# EAGLE schematic Longboard (EAGLE 9.1.3)

## Sheet 1 of 3
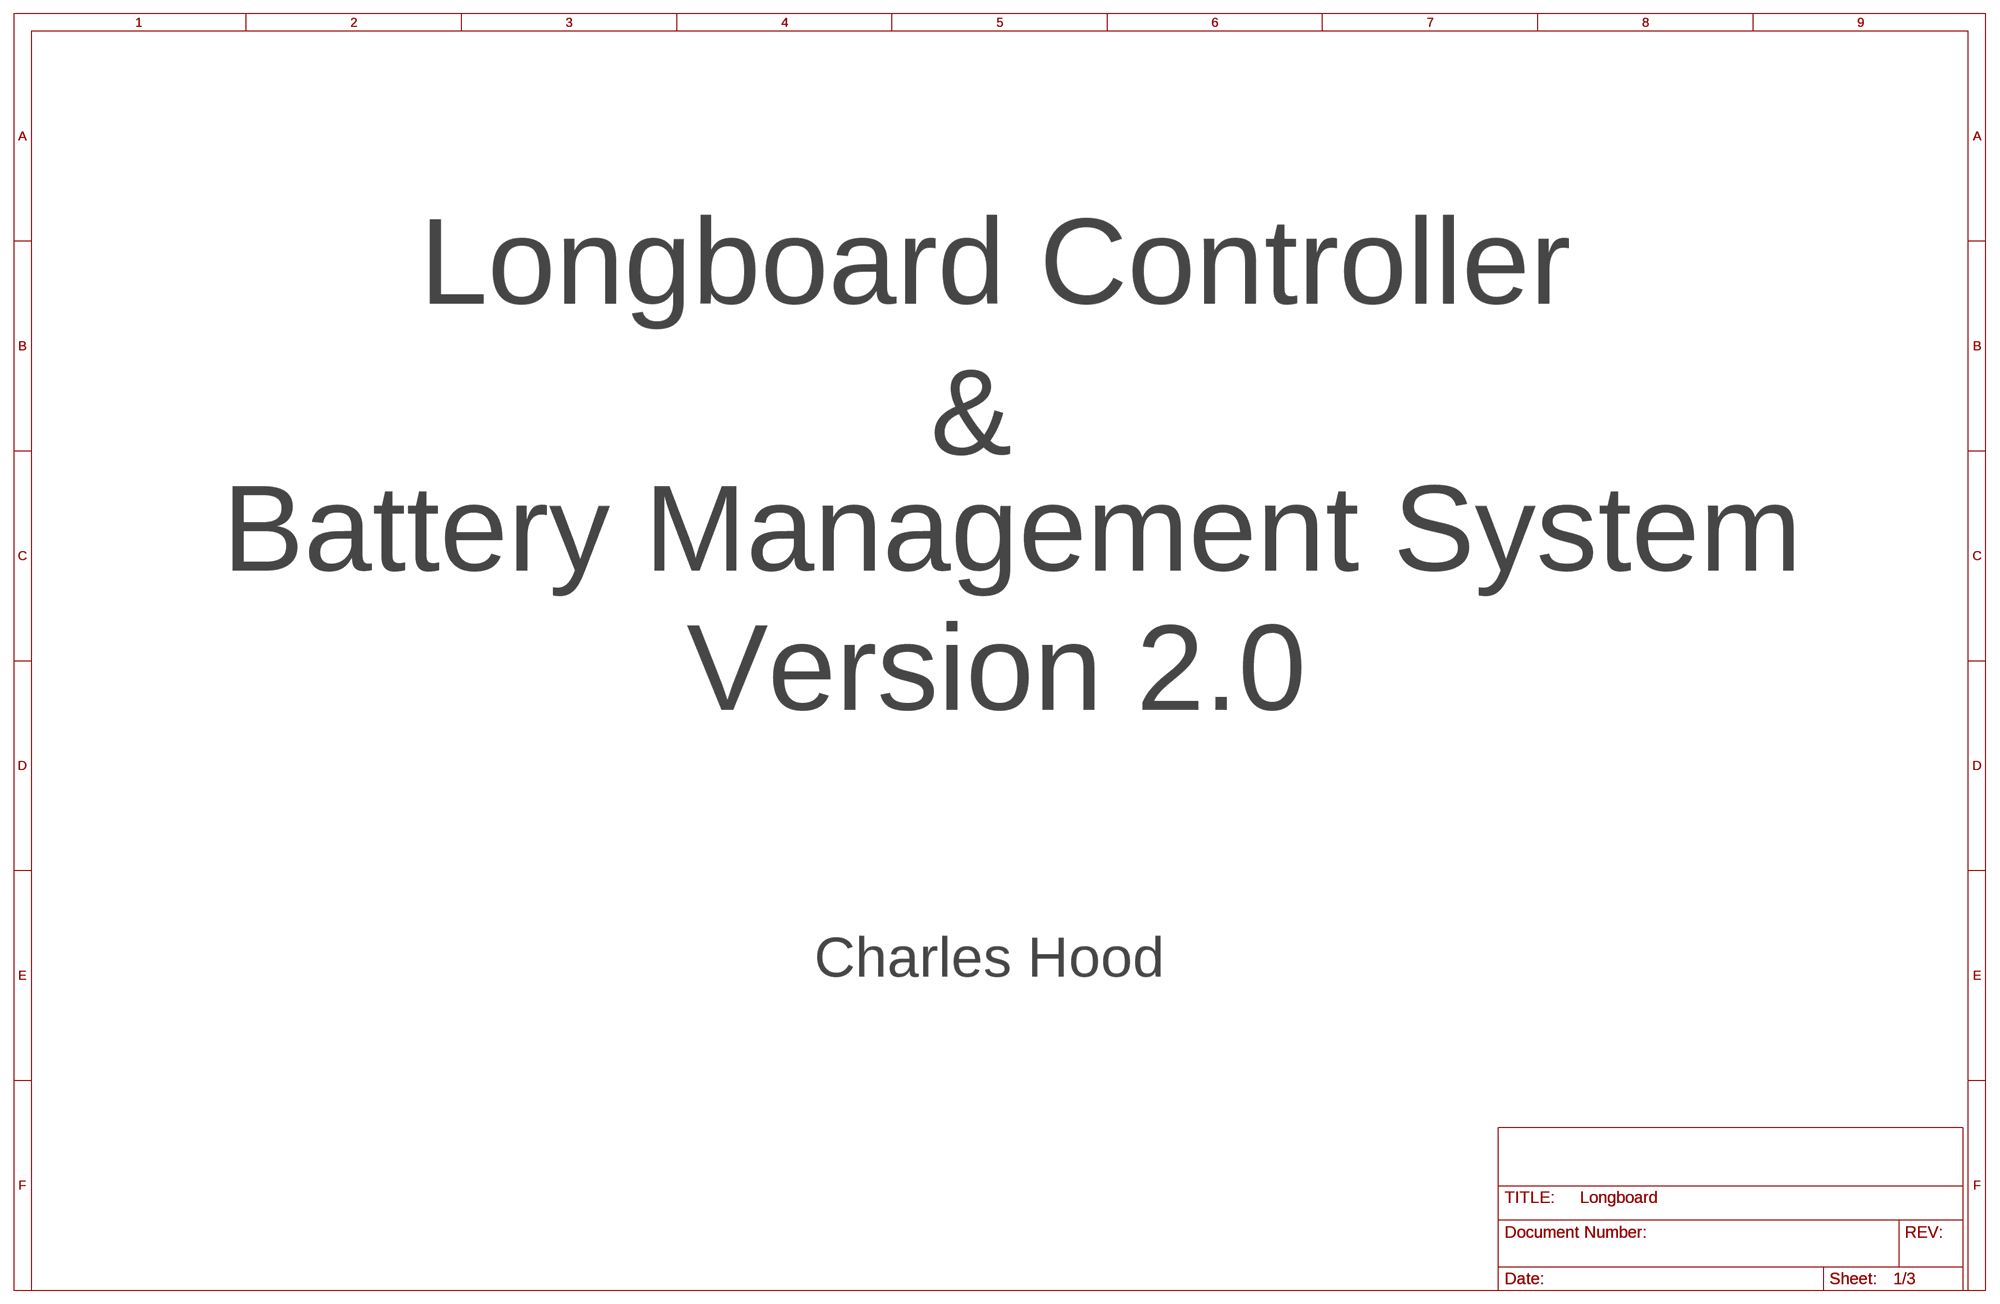
[diagram p0: schematic, sheet 1]

### Notes on the sheet
- Longboard Controller
- &
- Battery Management System
- Version 2.0
- Charles Hood

## Sheet 2 of 3
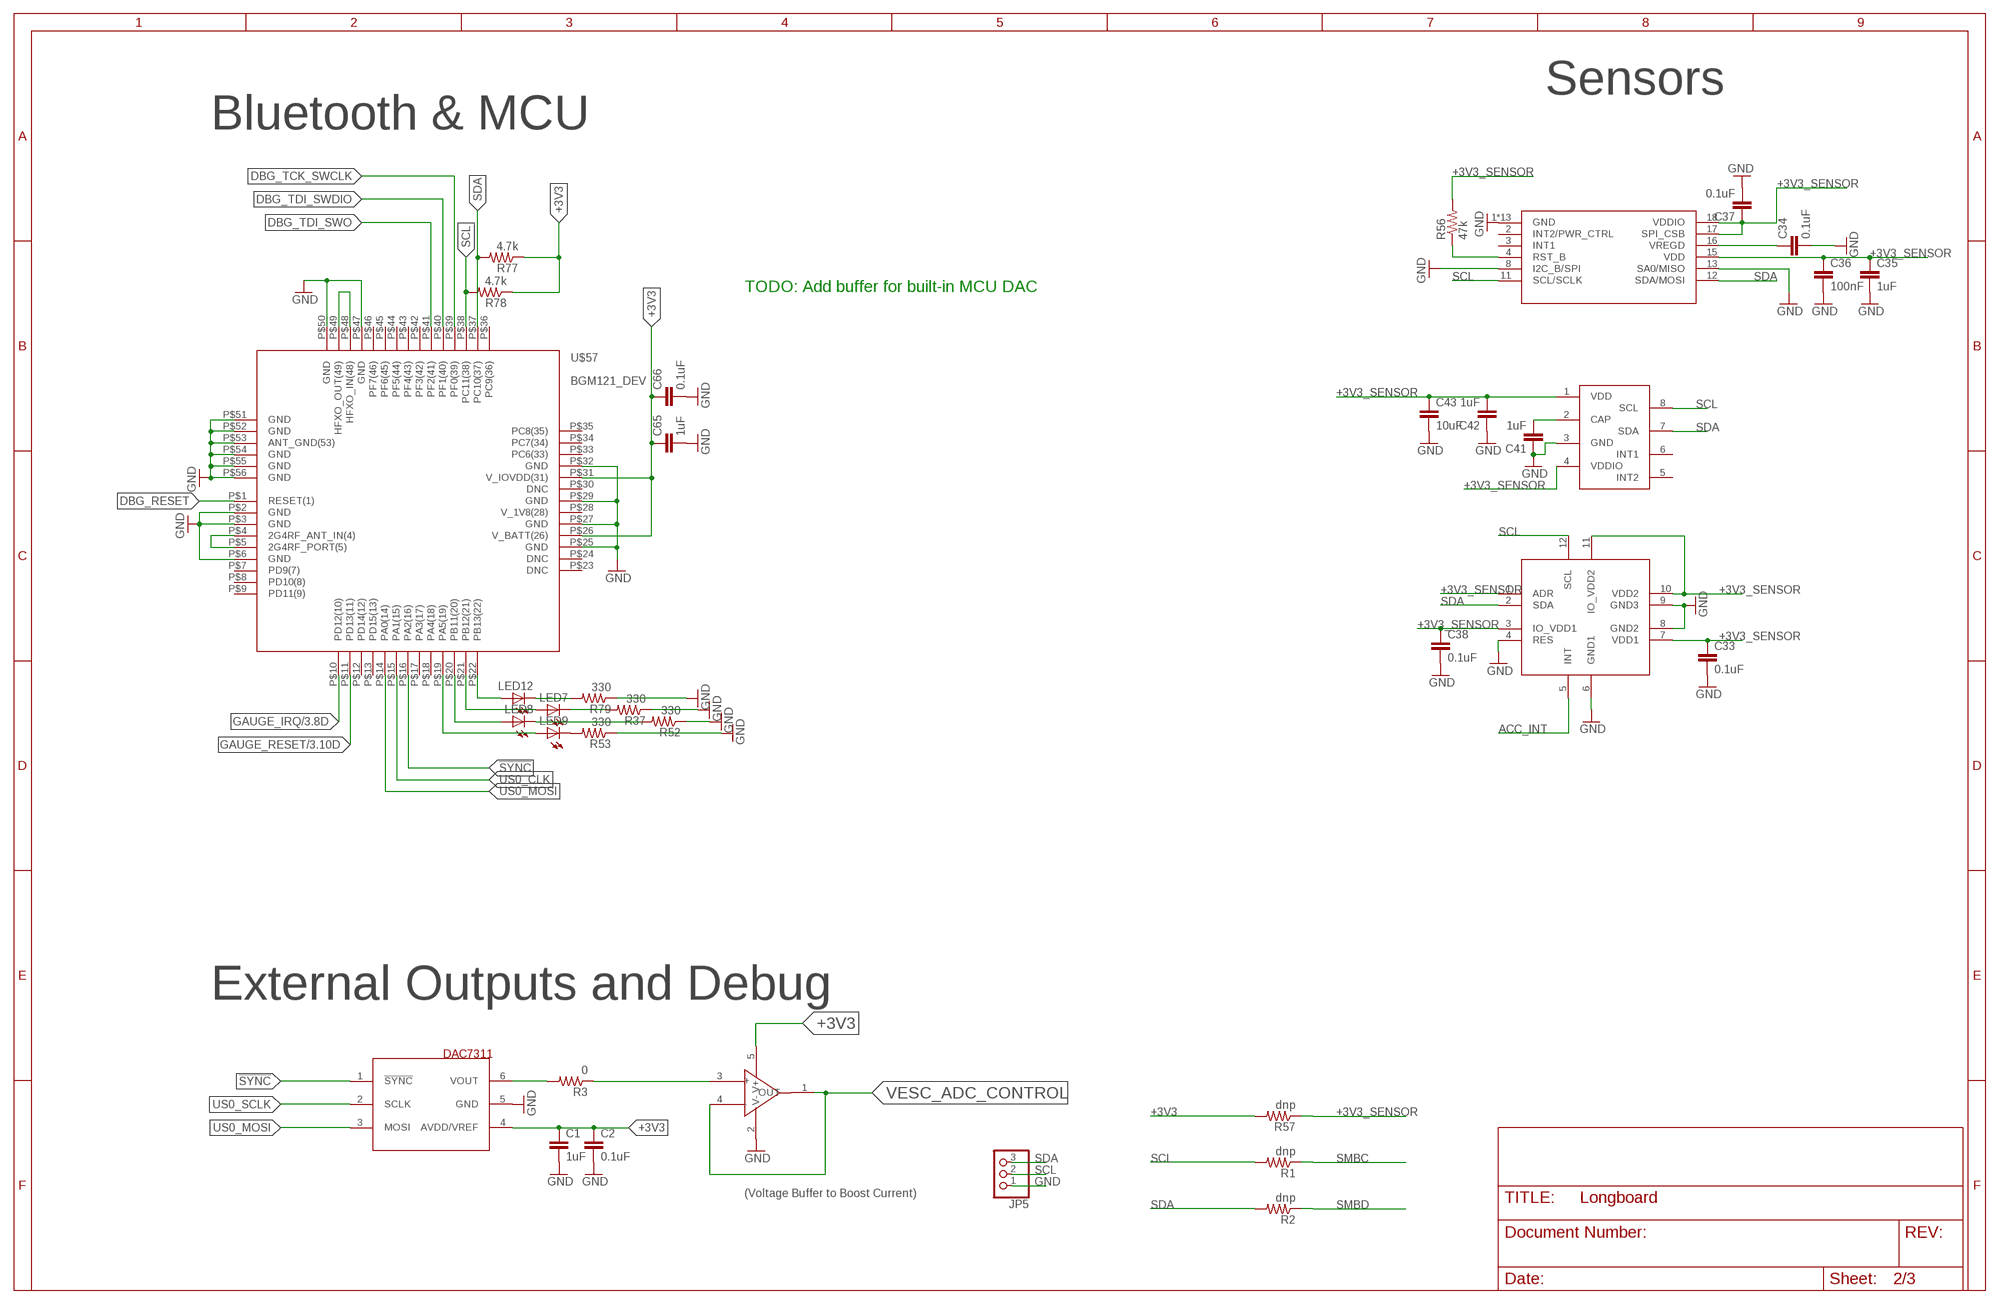
[diagram p1: schematic, sheet 2]

### Parts
C1  1uF  C-EUC0402  [C0402]
C2  0.1uF  C-EUC0402  [C0402]
C33  0.1uF  C-EUC0402  [C0402]
C34  0.1uF  C-EUC0402  [C0402]
C35  1uF  C-EUC0402  [C0402]
C36  100nF  C-EUC0402  [C0402]
C37  0.1uF  C-EUC0402  [C0402]
C38  0.1uF  C-EUC0402  [C0402]
C41  1uF  C-EUC0402  [C0402]
C42  1uF  C-EUC0402  [C0402]
C43  10uF  C-EUC0603  [C0603]
C65  1uF  C-EUC0402  [C0402]
C66  0.1uF  C-EUC0402  [C0402]
JP5  PINHD-1X3  [1X03]
LED7  LEDCHIP-LED0603  [CHIP-LED0603]
LED8  LEDCHIP-LED0603  [CHIP-LED0603]
LED9  LEDCHIP-LED0603  [CHIP-LED0603]
LED12  LEDCHIP-LED0603  [CHIP-LED0603]
R1  dnp  R-US_R0402  [R0402]
R2  dnp  R-US_R0402  [R0402]
R3  0  R-US_R0402  [R0402]
R37  330  R-US_R0402  [R0402]
R52  330  R-US_R0402  [R0402]
R53  330  R-US_R0402  [R0402]
R56  47k  R-US_R0402  [R0402]
R57  dnp  R-US_R0402  [R0402]
R77  4.7k  R-US_R0402  [R0402]
R78  4.7k  R-US_R0402  [R0402]
R79  330  R-US_R0402  [R0402]
U$1  DAC7311  [SOT363_6SOIC]
U$2  MCP6001  [SOT23-5L]
U$25  MLP3115A2  [MLP3115A2]
U$32  KXTJ3-1057  [LGA12]
U$34  FXAS21002  [FXAS21002]
U$57  BGM121_DEV  [BGM121_PAC]

### Nets
!SYNC: U$1.1(!SYNC) U$57.P$16(PA2(16))
+3V3: C1.1 C2.1 C65.1 C66.1 R57.2 R77.1 R78.1 U$1.4(AVDD/VREF) U$2.5(V+) U$57.P$26(V_BATT(26)) U$57.P$31(V_IOVDD(31))
+3V3_SENSOR: C33.1 C35.1 C36.1 C37.1 C38.1 C42.2 C43.1 R56.2 R57.1 U$25.1(VDD) U$25.4(VDDIO) U$32.1(ADR) U$32.3(IO_VDD1) U$32.7(VDD1) U$32.10(VDD2) U$32.11(IO_VDD2) U$34.15(VDD) U$34.17(SPI_CSB) U$34.18(VDDIO)
ACC_INT: U$32.5(INT)
DBG_RESET: U$57.P$1(RESET(1))
DBG_TCK_SWCLK: U$57.P$39(PF0(39))
DBG_TDI_SWDIO: U$57.P$40(PF1(40))
DBG_TDI_SWO: U$57.P$41(PF2(41))
GAUGE_IRQ: U$57.P$10(PD12(10)) ; also sheet 3
GAUGE_RESET: U$57.P$11(PD13(11)) ; also sheet 3
GND: C1.2 C2.2 C33.2 C34.2 C35.2 C36.2 C37.2 C38.2 C41.1 C42.1 C43.2 C65.2 C66.2 JP5.1 R37.1 R52.1 R53.1 R79.1 U$1.5(GND) U$2.2(V-) U$25.3(GND) U$32.4(RES) U$32.6(GND1) U$32.8(GND2) U$32.9(GND3) U$34.1(GND) U$34.5(GND) U$34.6(GND) U$34.7(GND) U$34.9(GND) U$34.10(GND) U$34.13(SA0/MISO) U$34.14(GND) U$34.19(GND) U$34.20(GND) U$34.21(GND) U$34.22(GND) U$34.23(GND) U$34.24(GND) U$57.P$2(GND) U$57.P$3(GND) U$57.P$6(GND) U$57.P$25(GND) U$57.P$27(GND) U$57.P$29(GND) U$57.P$32(GND) U$57.P$47(GND) U$57.P$50(GND) U$57.P$51(GND) U$57.P$52(GND) U$57.P$53(ANT_GND(53)) U$57.P$54(GND) U$57.P$55(GND) U$57.P$56(GND) ; also sheet 3
N$1: LED12.A U$57.P$22(PB13(22))
N$2: LED7.A U$57.P$21(PB12(21))
N$3: LED8.A U$57.P$20(PB11(20))
N$4: LED9.A U$57.P$19(PA5(19))
N$5: R3.2 U$1.6(VOUT)
N$6: R3.1 U$2.3(+)
N$13: U$34.8(I2C_B/SPI) ; supply symbol labelled GND
N$30: R56.1 U$34.4(RST_B)
N$36: LED7.C R37.2
N$42: LED8.C R52.2
N$74: LED9.C R53.2
N$78: C34.1 U$34.16(VREGD)
N$81: C41.2 U$25.2(CAP)
N$110: U$57.P$4(2G4RF_ANT_IN(4)) U$57.P$5(2G4RF_PORT(5))
N$112: LED12.C R79.2
N$113: U$57.P$48(HFXO_IN(48)) U$57.P$49(HFXO_OUT(49))
SCL: JP5.2 R1.2 R78.2 U$25.8(SCL) U$32.12(SCL) U$34.11(SCL/SCLK) U$57.P$38(PC11(38))
SDA: JP5.3 R2.2 R77.2 U$25.7(SDA) U$32.2(SDA) U$34.12(SDA/MOSI) U$57.P$37(PC10(37))
SMBC: R1.1 ; also sheet 3
SMBD: R2.1 ; also sheet 3
US0_CLK: U$57.P$15(PA1(15))
US0_MOSI: U$1.3(MOSI) U$57.P$14(PA0(14))
US0_SCLK: U$1.2(SCLK)
VESC_ADC_CONTROL: U$2.1(OUT) U$2.4(-)
Unconnected: U$25.5(INT2) U$25.6(INT1) U$34.2(INT2/PWR_CTRL) U$34.3(INT1) U$57.P$7(PD9(7)) U$57.P$8(PD10(8)) U$57.P$9(PD11(9)) U$57.P$12(PD14(12)) U$57.P$13(PD15(13)) U$57.P$17(PA3(17)) U$57.P$18(PA4(18)) U$57.P$23(DNC) U$57.P$24(DNC) U$57.P$30(DNC) U$57.P$33(PC6(33)) U$57.P$34(PC7(34)) U$57.P$35(PC8(35)) U$57.P$36(PC9(36)) U$57.P$42(PF3(42)) U$57.P$43(PF4(43)) U$57.P$44(PF5(44)) U$57.P$45(PF6(45)) U$57.P$46(PF7(46))

### Notes on the sheet
- Sensors
- Bluetooth & MCU
- TODO: Add buffer for built-in MCU DAC
- External Outputs and Debug
- (Voltage Buffer to Boost Current)

## Sheet 3 of 3
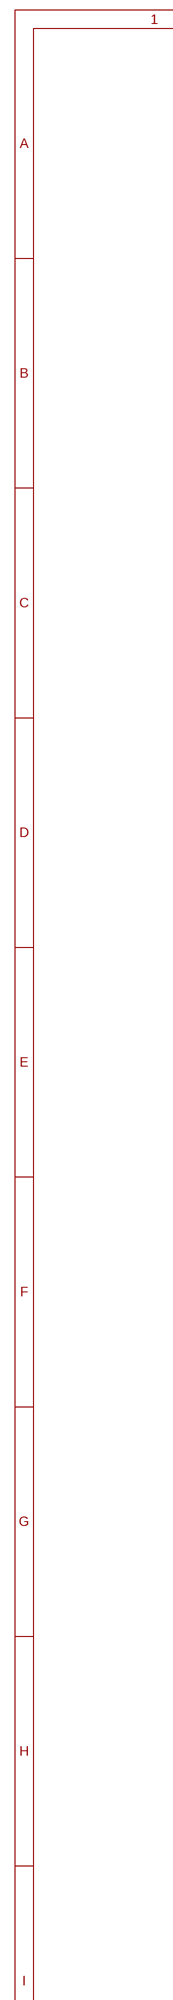
[diagram p2: schematic, sheet 3, part 1 of 2]
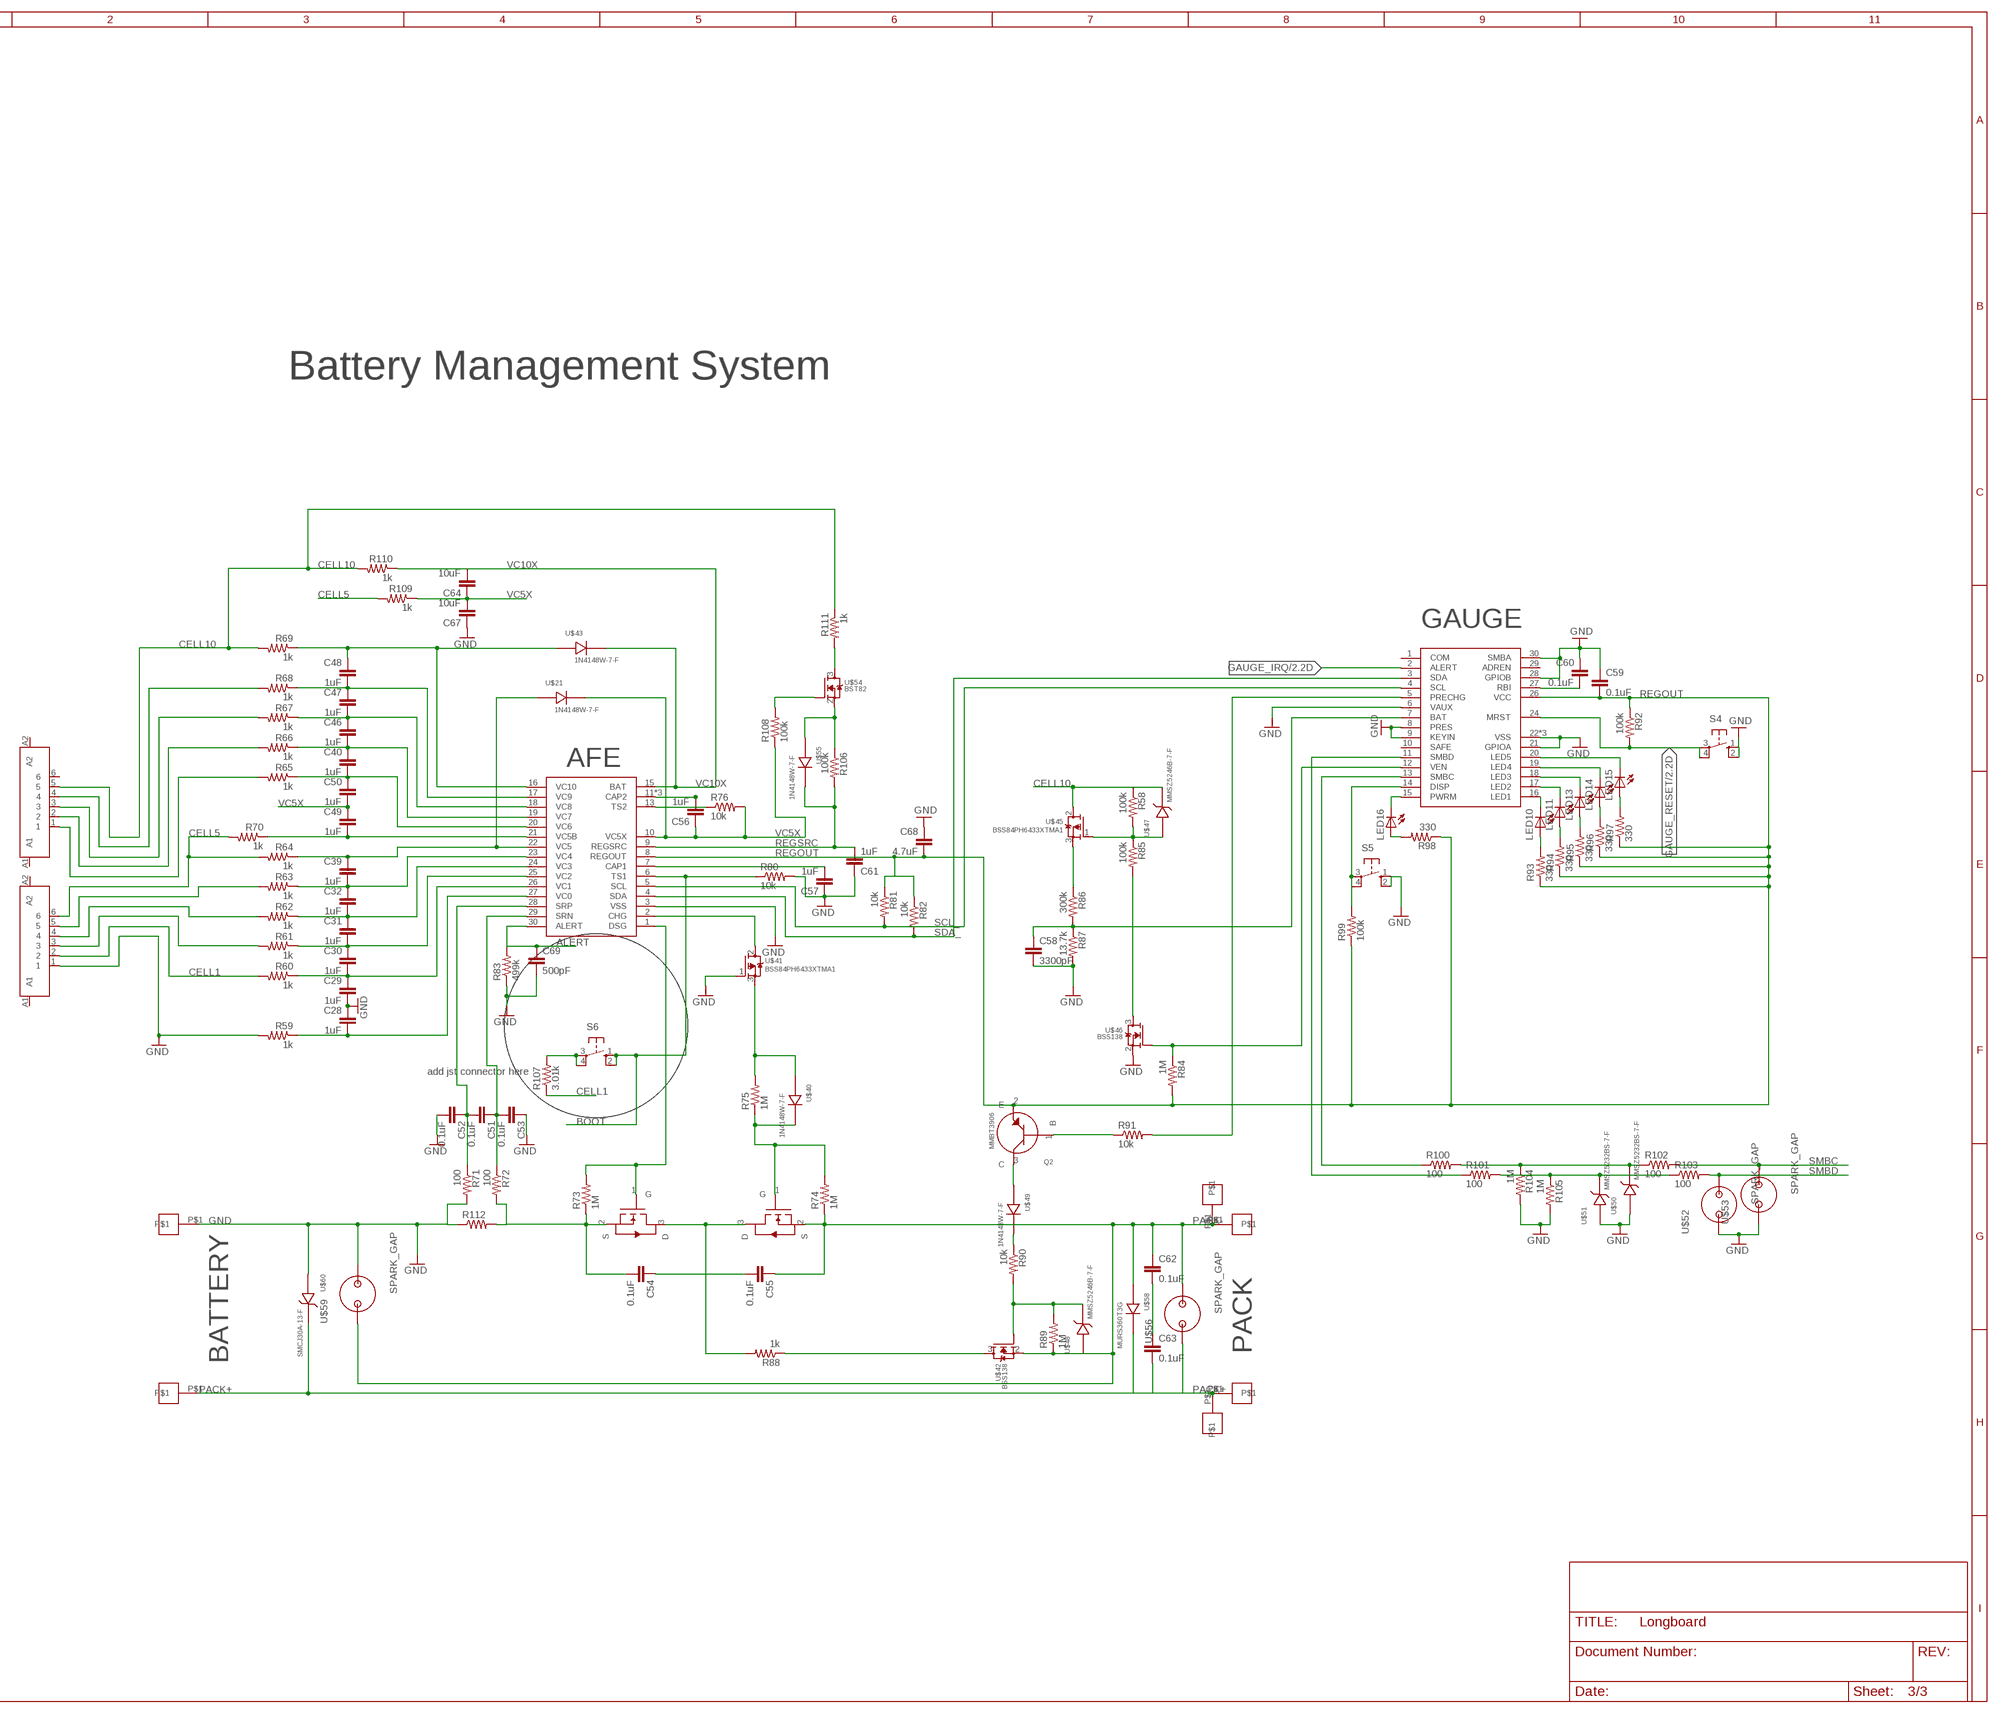
[diagram p3: schematic, sheet 3, part 2 of 2]

### Parts
C28  1uF  C-EUC0805  [C0805]
C29  1uF  C-EUC0805  [C0805]
C30  1uF  C-EUC0805  [C0805]
C31  1uF  C-EUC0805  [C0805]
C32  1uF  C-EUC0805  [C0805]
C39  1uF  C-EUC0805  [C0805]
C40  1uF  C-EUC0805  [C0805]
C46  1uF  C-EUC0805  [C0805]
C47  1uF  C-EUC0805  [C0805]
C48  1uF  C-EUC0805  [C0805]
C49  1uF  C-EUC0805  [C0805]
C50  1uF  C-EUC0805  [C0805]
C51  0.1uF  C-EUC0805  [C0805]
C52  0.1uF  C-EUC0805  [C0805]
C53  0.1uF  C-EUC0805  [C0805]
C54  0.1uF  C-EUC0805  [C0805]
C55  0.1uF  C-EUC0805  [C0805]
C56  1uF  C-EUC0805  [C0805]
C57  1uF  C-EUC0805  [C0805]
C58  3300pF  C-EUC0402  [C0402]
C59  0.1uF  C-EUC0805  [C0805]
C60  0.1uF  C-EUC0805  [C0805]
C61  1uF  C-EUC0805  [C0805]
C62  0.1uF  C-EUC0805  [C0805]
C63  0.1uF  C-EUC0805  [C0805]
C64  10uF  C-EUC1210  [C1210]
C67  10uF  C-EUC1210  [C1210]
C68  4.7uF  C-EUC0805  [C0805]
C69  500pF  C-EUC0603  [C0603]
LED10  LEDCHIPLED_0603  [CHIPLED_0603]
LED11  LEDCHIPLED_0603  [CHIPLED_0603]
LED13  LEDCHIPLED_0603  [CHIPLED_0603]
LED14  LEDCHIPLED_0603  [CHIPLED_0603]
LED15  LEDCHIPLED_0603  [CHIPLED_0603]
LED16  LEDCHIPLED_0603  [CHIPLED_0603]
Q2  MMBT3906  [SOT23-3]
R58  100k  R-US_R0805  [R0805]
R59  1k  R-US_R1206  [R1206]
R60  1k  R-US_R1206  [R1206]
R61  1k  R-US_R1206  [R1206]
R62  1k  R-US_R1206  [R1206]
R63  1k  R-US_R1206  [R1206]
R64  1k  R-US_R1206  [R1206]
R65  1k  R-US_R1206  [R1206]
R66  1k  R-US_R1206  [R1206]
R67  1k  R-US_R1206  [R1206]
R68  1k  R-US_R1206  [R1206]
R69  1k  R-US_R1206  [R1206]
R70  1k  R-US_R1206  [R1206]
R71  100  R-US_R0805  [R0805]
R72  100  R-US_R0805  [R0805]
R73  1M  R-US_R1206  [R1206]
R74  1M  R-US_R1206  [R1206]
R75  1M  R-US_R1206  [R1206]
R76  10k  R-US_R0805  [R0805]
R80  10k  R-US_R0805  [R0805]
R81  10k  R-US_R0805  [R0805]
R82  10k  R-US_R0805  [R0805]
R83  499k  R-US_R0603  [R0603]
R84  1M  R-US_R1206  [R1206]
R85  100k  R-US_R0805  [R0805]
R86  300k  R-US_R0805  [R0805]
R87  13.7k  R-US_R0805  [R0805]
R88  1k  R-US_R2512  [R2512]
R89  1M  R-US_R1206  [R1206]
R90  10k  R-US_R0805  [R0805]
R91  10k  R-US_R0805  [R0805]
R92  100k  R-US_R0805  [R0805]
R93  330  R-US_R0402  [R0402]
R94  330  R-US_R0402  [R0402]
R95  330  R-US_R0402  [R0402]
R96  330  R-US_R0402  [R0402]
R97  330  R-US_R0402  [R0402]
R98  330  R-US_R0402  [R0402]
R99  100k  R-US_R0402  [R0402]
R100  100  R-US_R0805  [R0805]
R101  100  R-US_R0805  [R0805]
R102  100  R-US_R0805  [R0805]
R103  100  R-US_R0805  [R0805]
R104  1M  R-US_R1206  [R1206]
R105  1M  R-US_R1206  [R1206]
R106  100k  R-US_R0805  [R0805]
R107  3.01k  R-US_R1206  [R1206]
R108  100k  R-US_R0805  [R0805]
R109  1k  R-US_R1206  [R1206]
R110  1k  R-US_R1206  [R1206]
R111  1k  R-US_R1206  [R1206]
R112  R-US_R2512  [R2512]
S4  10-XX  [B3F-10XX]
S5  10-XX  [B3F-10XX]
S6  10-XX  [B3F-10XX]
U$20  BQ76930  [SOIC-30]
U$21  1N4148W-7-F  [SOD-123]
U$22  AOB290L  [TO-263]
U$23  AOB290L  [TO-263]
U$40  1N4148W-7-F  [SOD-123]
U$41  BSS84PH6433XTMA1  [SOT23-3]
U$42  BSS138  [SOT23-3]
U$43  1N4148W-7-F  [SOD-123]
U$44  BQ78350-R1  [SOIC-30]
U$45  BSS84PH6433XTMA1  [SOT23-3]
U$46  BSS138  [SOT23-3]
U$47  MMSZ5246B-7-F  [SOD-123]
U$48  MMSZ5246B-7-F  [SOD-123]
U$49  1N4148W-7-F  [SOD-123]
U$50  MMSZ5232BS-7-F  [SOD-323F]
U$51  MMSZ5232BS-7-F  [SOD-323F]
U$52  SPARK_GAP  [SPARK_GAP]
U$53  SPARK_GAP  [SPARK_GAP]
U$54  BST82  [SOT23-3]
U$55  1N4148W-7-F  [SOD-123]
U$56  SPARK_GAP  [SPARK_GAP]
U$58  MURS360T3G  [SMC(DO-214AB)]
U$59  SPARK_GAP  [SPARK_GAP]
U$60  SMCJ30A-13-F  [SMB(DO-214AA)]
U$61  JST_6PIN  [JST_6PIN]
U$62  JST_6PIN  [JST_6PIN]
U$63  PAD  [PAD]
U$64  PAD  [PAD]
U$65  PAD  [PAD]
U$66  PAD  [PAD]
U$67  PAD  [PAD]
U$68  PAD  [PAD]

### Nets
ALERT: C69.1 R83.2 U$20.30(ALERT)
BOOT: R80.1 S6.1(S) S6.2(S1) U$20.6(TS1)
CELL1: R60.2 R107.1 U$62.2
CELL5: R64.2 R70.2 R109.2 U$62.6
CELL10: R58.1 R69.2 R110.2 R111.1 U$45.2(S) U$47.P$2 U$61.5
GAUGE_IRQ: U$44.2(ALERT) ; also sheet 2
GAUGE_RESET: R92.2 S4.3(P) S4.4(P1) U$44.24(MRST) ; also sheet 2
GND: C28.1 C29.2 C52.2 C53.1 C57.1 C58.2 C59.1 C60.1 C61.1 C67.1 C68.1 C69.2 R59.2 R71.2 R80.2 R83.1 R87.2 R104.2 R105.2 R112.1 S4.1(S) S4.2(S1) S5.1(S) S5.2(S1) U$20.3(VSS) U$41.1(G) U$44.6(VAUX) U$44.8(PRES) U$44.9(KEYIN) U$44.21(GPIOA) U$44.22(VSS) U$44.23(VSS) U$44.25(VSS) U$44.28(GPIOB) U$44.30(SMBA) U$46.2(S) U$50.1 U$51.1 U$52.P$1 U$53.P$1 U$59.P$2 U$60.P$1 U$62.1 U$63.P$1 ; also sheet 2
N$75: C29.1 C30.2 R60.1 U$20.26(VC1)
N$76: C30.1 C31.2 R61.1 U$20.25(VC2)
N$77: C31.1 C32.2 R62.1 U$20.24(VC3)
N$79: C32.1 C39.2 R63.1 U$20.23(VC4)
N$80: C39.1 R64.1 U$20.22(VC5) U$21.P$1
N$82: C40.1 C46.2 R66.1 U$20.19(VC7)
N$83: C46.1 C47.2 R67.1 U$20.18(VC8)
N$84: C47.1 C48.2 R68.1 U$20.17(VC9)
N$85: C48.1 R69.1 U$20.16(VC10) U$43.P$1
N$86: C28.2 R59.1 U$20.27(VC0)
N$87: R61.2 U$62.3
N$88: R62.2 U$62.4
N$90: R63.2 U$62.5
N$91: R65.2 U$61.1
N$92: R66.2 U$61.2
N$93: R67.2 U$61.3
N$94: R68.2 U$61.4
N$95: C49.2 R70.1 U$20.21(VC5B)
N$96: C40.2 C50.1 R65.1 U$20.20(VC6)
N$97: C51.1 C53.2 R72.1 U$20.29(SRN)
N$98: C51.2 C52.1 R71.1 U$20.28(SRP)
N$99: C54.2 R72.2 R73.1 R112.2 U$22.2(S)
N$100: R88.2 U$22.3(D) U$23.3(D)
N$101: R74.2 R75.1 U$23.1(G) U$40.P$2
N$102: R75.2 U$40.P$1 U$41.3(D)
N$103: U$20.2(CHG) U$41.2(S)
N$104: C54.1 C55.2
N$105: C56.2 U$20.11(CAP2) U$20.12(CAP2) U$20.14(CAP2)
N$106: R76.1 U$20.13(TS2)
N$107: C57.2 U$20.7(CAP1)
N$108: R84.1 U$44.12(VEN) U$46.1(G)
N$109: R85.2 U$46.3(D)
N$114: R58.2 R85.1 U$45.1(G) U$47.P$1
N$115: R86.1 U$45.3(D)
N$116: C58.1 R86.2 R87.1 U$44.7(BAT)
N$117: R88.1 U$42.3(D)
N$118: R89.2 R90.2 U$42.1(G) U$48.P$2
N$119: Q2.3(C) U$49.P$1
N$120: R90.1 U$49.P$2
N$121: Q2.1(B) R91.1
N$122: C60.2 U$44.27(RBI)
N$124: LED10.A R93.2
N$125: LED11.A R94.2
N$126: LED13.A R95.2
N$127: LED14.A R96.2
N$128: LED15.A R97.2
N$129: LED10.C U$44.16(LED1)
N$130: LED11.C U$44.17(LED2)
N$131: LED13.C U$44.18(LED3)
N$132: LED14.C U$44.19(LED4)
N$133: LED15.C U$44.20(LED5)
N$134: LED16.A R98.2
N$135: R99.2 S5.3(P) S5.4(P1) U$44.14(DISP)
N$136: LED16.C U$44.15(PWRM)
N$137: R91.2 U$44.5(PRECHG)
N$138: R101.1 U$44.11(SMBD)
N$139: R100.1 U$44.13(SMBC)
N$140: R100.2 R102.1 R104.1 U$50.2
N$141: R101.2 R103.1 R105.1 U$51.2
N$142: R106.1 U$54.2(S) U$55.P$1
N$143: R111.2 U$54.3(D)
N$144: R73.2 U$20.1(DSG) U$22.1(G)
N$145: R107.2 S6.3(P) S6.4(P1)
N$146: C62.2 C63.1
N$147: R108.2 U$54.1(G)
PACK+: C63.2 U$56.P$1 U$58.2 U$60.P$2 U$64.P$1 U$65.P$1 U$68.P$1
PACK-: C55.1 C62.1 R74.1 R89.1 U$23.2(S) U$42.2(S) U$48.P$1 U$56.P$2 U$58.1 U$59.P$1 U$66.P$1 U$67.P$1
REGOUT: C59.2 C68.2 Q2.2(E) R81.1 R82.1 R84.2 R92.1 R93.1 R94.1 R95.1 R96.1 R97.1 R98.1 R99.1 U$20.8(REGOUT) U$44.26(VCC)
REGSRC: C61.2 R106.2 U$20.9(REGSRC) U$55.P$2
SCL_: R81.2 U$20.5(SCL) U$44.4(SCL)
SDA_: R82.2 U$20.4(SDA) U$44.3(SDA)
SMBC: R102.2 U$53.P$2 ; also sheet 2
SMBD: R103.2 U$52.P$2 ; also sheet 2
VC5X: C49.1 C50.2 C56.1 C64.1 C67.2 R76.2 R108.1 R109.1 U$20.10(VC5X) U$21.P$2
VC10X: C64.2 R110.1 U$20.15(BAT) U$43.P$2
Unconnected: U$44.1(COM) U$44.10(SAFE) U$44.29(ADREN) U$61.6 U$61.A1 U$61.A2 U$62.A1 U$62.A2

### Notes on the sheet
- Battery Management System
- GAUGE
- AFE
- add jst connector here
- PACK
- BATTERY

## Power pins joined to a net without a drawn wire
V_1V8(28): U$57.P$28(V_1V8(28))

## Library data of the parts
C1 C2 C28-C32 C34-C37 C39-C43 C46-C69 = rcl:C-EU: CAPACITOR, European symbol
C33 C38 = rcl:C-EU: CAPACITOR, European symbol; OC_NEWARK: unknown
JP5 = pinhead:PINHD-1X3: PIN HEADER
LED7-LED16 = adafruit:LED: LED OSRAM: - CHIPLED LG R971, LG N971, LY N971, LG Q971, LY Q971, LO R971, LY R971 LH N974, LH R974 LS Q976, LO Q976, LY Q976 LO Q996 - Hyper CHIPLED LW Q18S LB Q993, LB Q99A, LB R99A - SideLED LS A670, LO A670, LY A670, LG A670, LP A670 LB A673, LV A673, LT A673, LW A673 LH A674 LY A675 LS A676, LA A676, LO A676, LY A676, LW A676 LS A679, LY A679, LG A679 - Hyper Micro SIDELED® LS Y876, LA Y876, LO Y876, LY Y876 LT Y87S - SmartLED LW L88C, LW L88S LB L89C, LB L89S, LG L890 LS L89K, LO L89K, LY L89K LS L896, LA L896, LO L896, LY L896 - TOPLED LS T670, LO T670, LY T670, LG T670, LP T670 LSG T670, LSP T670, LSY T670, LOP T670, LYG T670 LG T671, LOG T671, LSG T671 LB T673, LV T673, LT T673, LW T673 LH T674 LS T676, LA T676, LO T676, LY T676, LB T676, LH T676, LSB T676, LW T676 LB T67C, LV T67C, LT T67C, LS T67K, LO T67K, LY T67K, LW E67C LS E67B, LA E67B, LO E67B, LY E67B, LB E67C, LV E67C, LT E67C LW T67C LS T679, LY T679, LG T679 LS T770, LO T770, LY T770, LG T770, LP T770 LB T773, LV T773, LT T773, LW T773 LH T774 LS E675, LA E675, LY E675, LS T675 LS T776, LA T776, LO T776, LY T776, LB T776 LHGB T686 LT T68C, LB T68C - Hyper Mini TOPLED® LB M676 - Mini TOPLED Santana® LG M470 LS M47K, LO M47K, LY M47K Source: http://www.osram.convergy.de/
Q2 = Charles:MMBT3906: TRANSISTOR PNP 40V 0.2A
R1-R3 R37 R52 R53 R56-R112 = rcl:R-US_: RESISTOR, American symbol
S4-S6 = switch-omron:10-XX: OMRON SWITCH; MPN: B3F-1000; OC_FARNELL: 176432; OC_NEWARK: 36M3542
U$1 = Charles:DAC7311: 2-V to 5.5-V, 80-µA, 8-, 10-, and 12-Bit, Low-Power, Single-Channel, Digital-to-Analog Converters in SC70 Package
U$2 = James_Updated:MCP6001
U$20 = Charles:BQ76930
U$21 U$40 U$43 U$49 U$55 = Charles:1N4148W-7-F: DIODE GENERAL PURPOSE 100V 300MA
U$22 U$23 = Charles:AOB290L
U$25 = Charles:MLP3115A2: I2C Precision Altimeter
U$32 = James_Updated:KXTJ3-1057
U$34 = Charles:FXAS21002: 3-Axis Digital Angular Rate Gyroscope (I2C/SPI)
U$41 U$45 = Charles:BSS84PH6433XTMA1: MOSFET P-Channel 60V 170MA SOT-23
U$42 U$46 = Charles:BSS138: MOSFET N-CH 50V 220MA
U$44 = Charles:BQ78350-R1
U$47 U$48 = Charles:MMSZ5246B-7-F: ZENER DIODE 16V 500MW
U$50 U$51 = Charles:MMSZ5232BS-7-F: ZENER DIODE 5.6V 200MW
U$52 U$53 U$56 U$59 = Charles:SPARK_GAP: Spark Gap 0.2mm ~2kV for ESD Protection
U$54 = Charles:BST82: MOSFET N-CH 50V 220MA
U$57 = BGM121:BGM121_DEV: BGM121 - Blue Gecko BGM111 Bluetooth Smart® SiP Module Technical Specifications: Bluetooth 4.2 compliant Configurable TX power up to +8 dBm Range up to 200 meters ARM® Cortex-M4 @ up to 38.4 MHz Arrow: BGM121A256V1 <https://www.arrow.com/en/products/search?q=bgm121> Digikey: 336-3811-1-ND <https://www.digikey.com/product-search/en/rf-if-and-rfid/rf-transceiver-modules/3539948?k=bgm121> Mouser: 634-BGM121A256V1 <http://www.mouser.com/Search/Refine.aspx?Keyword=bgm121>
U$58 = Charles:MURS360T3G: Ultrafast Power Rectifier, Diode General Purpose 600V 3A
U$60 = Charles:SMCJ30A-13-F: Zener Diode - 600 Watt Transient Voltage Suppressor - 30VWM 48.4VC - Diode Inc.
U$61 U$62 = James_Updated:JST_6PIN
U$63-U$68 = Charles:PAD

## Net classes
0 default: width 0.152 mm, drill 0.305 mm, clearance 0.152 mm
1 power: width 0.203 mm, drill 0.305 mm, clearance 0.152 mm